# EAGLE design BlinkMuinoShield (EAGLE 5.11)
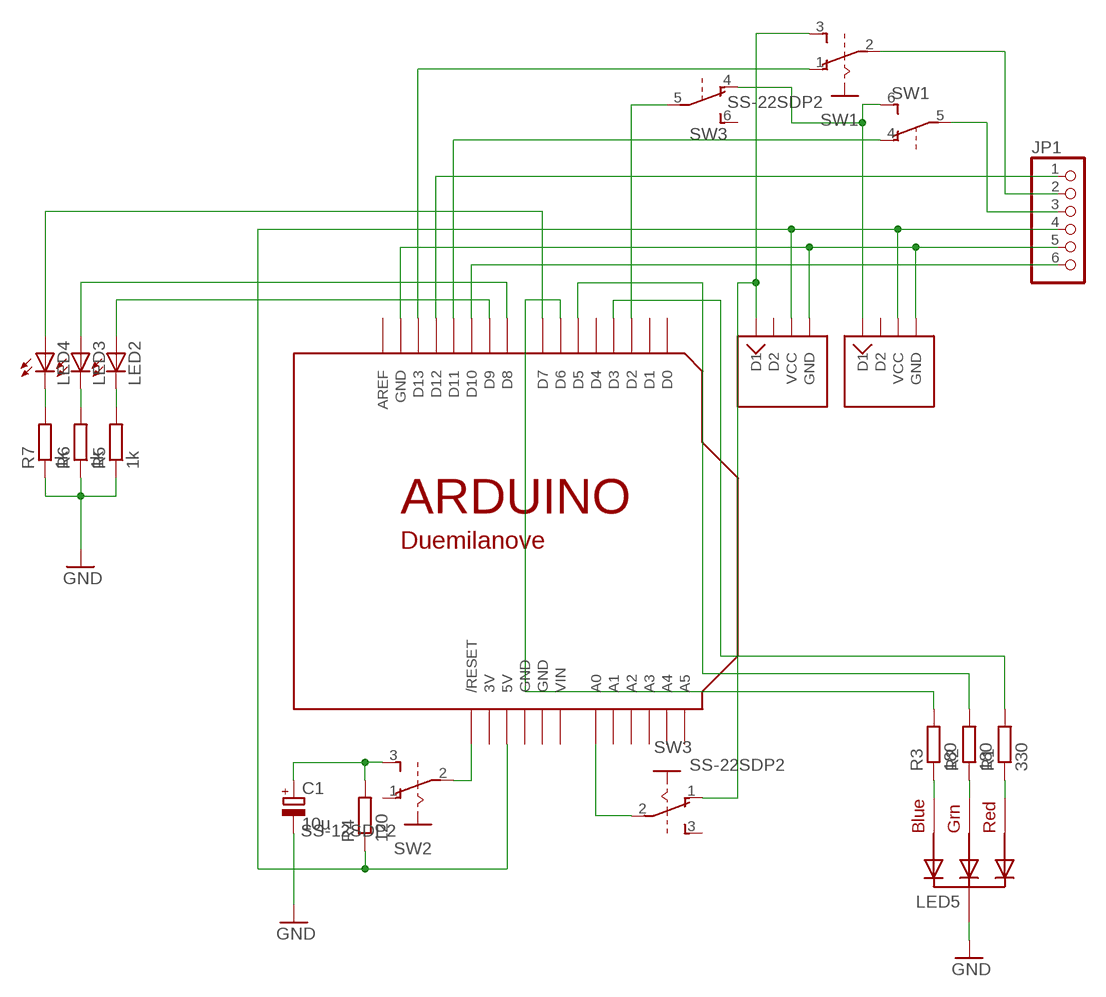
[diagram p0: schematic, sheet 1]

## Parts
C1  10µ  CPOL-EUE2.5-5  [E2,5-5]
JP1  PINHD-1X6LOCK  [1X06-BIGLOCK]
LED2  LED3MM  [LED3MM]
LED3  LED3MM  [LED3MM]
LED4  LED3MM  [LED3MM]
LED5  RGBLED_CK  [PIRANHA5MM]
R1  330  R-EU_0204/5  [0204/5]
R2  180  R-EU_0204/5  [0204/5]
R3  180  R-EU_0204/5  [0204/5]
R4  120  R-EU_0204/5  [0204/5]
R5  1k  R-EU_0204/5  [0204/5]
R6  1k  R-EU_0204/5  [0204/5]
R7  1k  R-EU_0204/5  [0204/5]
SW1  SS-22SDP2  [SS-22SDP2]
SW2  SS-12SDP2  [SS-12SDP2]
SW3  SS-22SDP2  [SS-22SDP2]
U$1  ARDUINODUEMILANOVE-NOHOLES  [ARDUINO-NOHOLE]
U$2  TWIG-4PIN  [TWIG-4PIN-L]
U$3  TWIG-4PIN  [TWIG-4PIN-L]

## Nets
GND: C1.- JP1.5 LED5.2(GND) R5.1 R6.1 R7.1 U$1.GND U$2.GND U$3.GND
N$1: JP1.6 U$1.D10
N$2: SW2.2(P) U$1.RESET(/RESET)
N$3: JP1.4 R4.1 U$1.5V U$2.VCC U$3.VCC
N$4: JP1.1 U$1.D12
N$5: SW1.1(O) U$1.D13
N$6: JP1.2 SW1.2(P)
N$7: JP1.3 SW1.5(P)
N$8: SW1.4(O) U$1.D11
N$9: SW1.3(S) SW3.1(O) U$2.D1
N$10: SW1.6(S) SW3.4(O) U$3.D1
N$11: C1.+ R4.2 SW2.3(S)
N$12: SW3.2(P) U$1.A0
N$13: SW3.5(P) U$1.D2
N$14: LED5.3(BLUE) R3.1
N$15: LED5.1(GREEN) R2.1
N$16: LED5.4(RED) R1.1
N$17: R1.2 U$1.D3
N$18: R2.2 U$1.D5
N$19: R3.2 U$1.D6
N$21: LED2.A U$1.D9
N$22: LED3.A U$1.D8
N$23: LED4.A U$1.D7
N$24: LED4.K(C) R7.2
N$25: LED3.K(C) R6.2
N$26: LED2.K(C) R5.2
Unconnected: SW2.1(O) SW3.3(S) SW3.6(S) U$1.A1 U$1.A2 U$1.A3 U$1.A4 U$1.A5 U$1.AREF U$1.D0 U$1.D1 U$1.D4 U$2.D2 U$3.D2

## Power pins joined to a net without a drawn wire
3V: U$1.3V
GND: U$1.GND1(GND) U$1.GND2(GND)
VIN: U$1.VIN

## Library data of the parts
C1 = rcl:CPOL-EU: POLARIZED CAPACITOR, European symbol
JP1 = adafruit:PINHD-1X6: PIN HEADER
LED2-LED4 = SparkFun:LED: LEDs Standard schematic elements and footprints for 5mm, 3mm, 1206, and 0603 sized LEDs. 5mm - Spark Fun Electronics SKU : COM-00529 (and others)
LED5 = kotobuki:RGBLED_CK
R1-R7 = rcl:R-EU_: RESISTOR, European symbol
SW1 SW3 = nikkai_ss:SS-22S
SW2 = nikkai_ss:SS-12S
U$1 = kotobuki:ARDUINO: Arduino Diecimila/Duemilanove Make a shield with ease, this package has all the named pins as well as the two mounting drill holes and an outline of the USB and DC power connector. The outline is on the DIMENSION layer, so if your board house uses it they will cut the outline to match. http://www.ladyada.net/library/pcb/eaglelibrary.html
U$2 U$3 = kotobuki:TWIG-4PIN

## Board
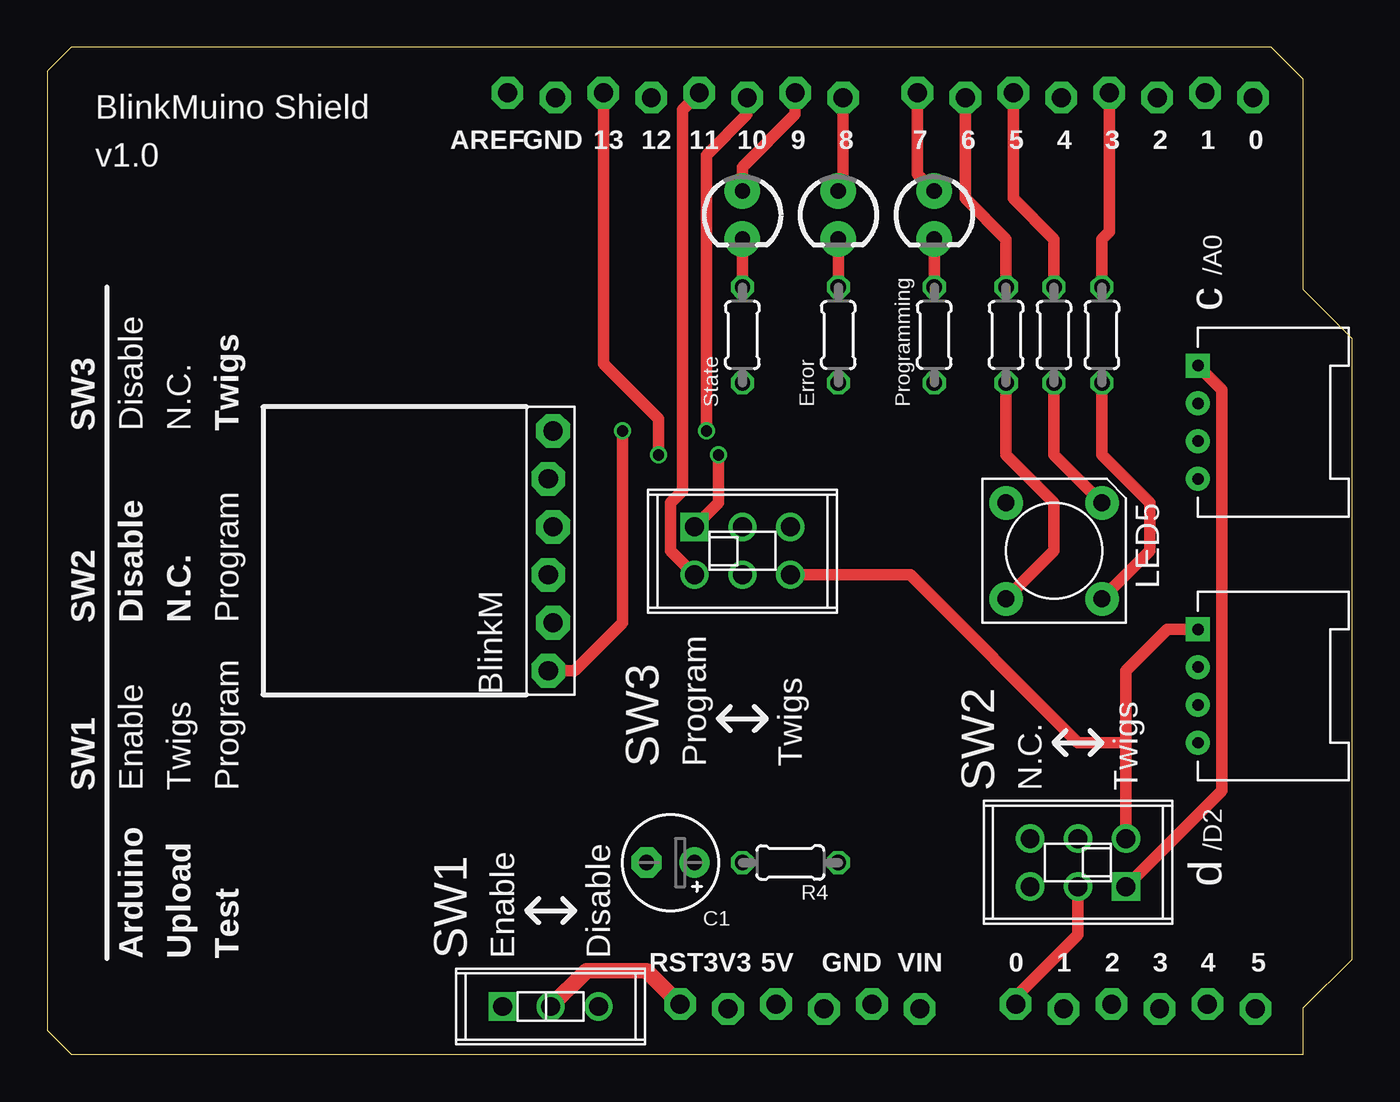
[diagram p1: board, top side]
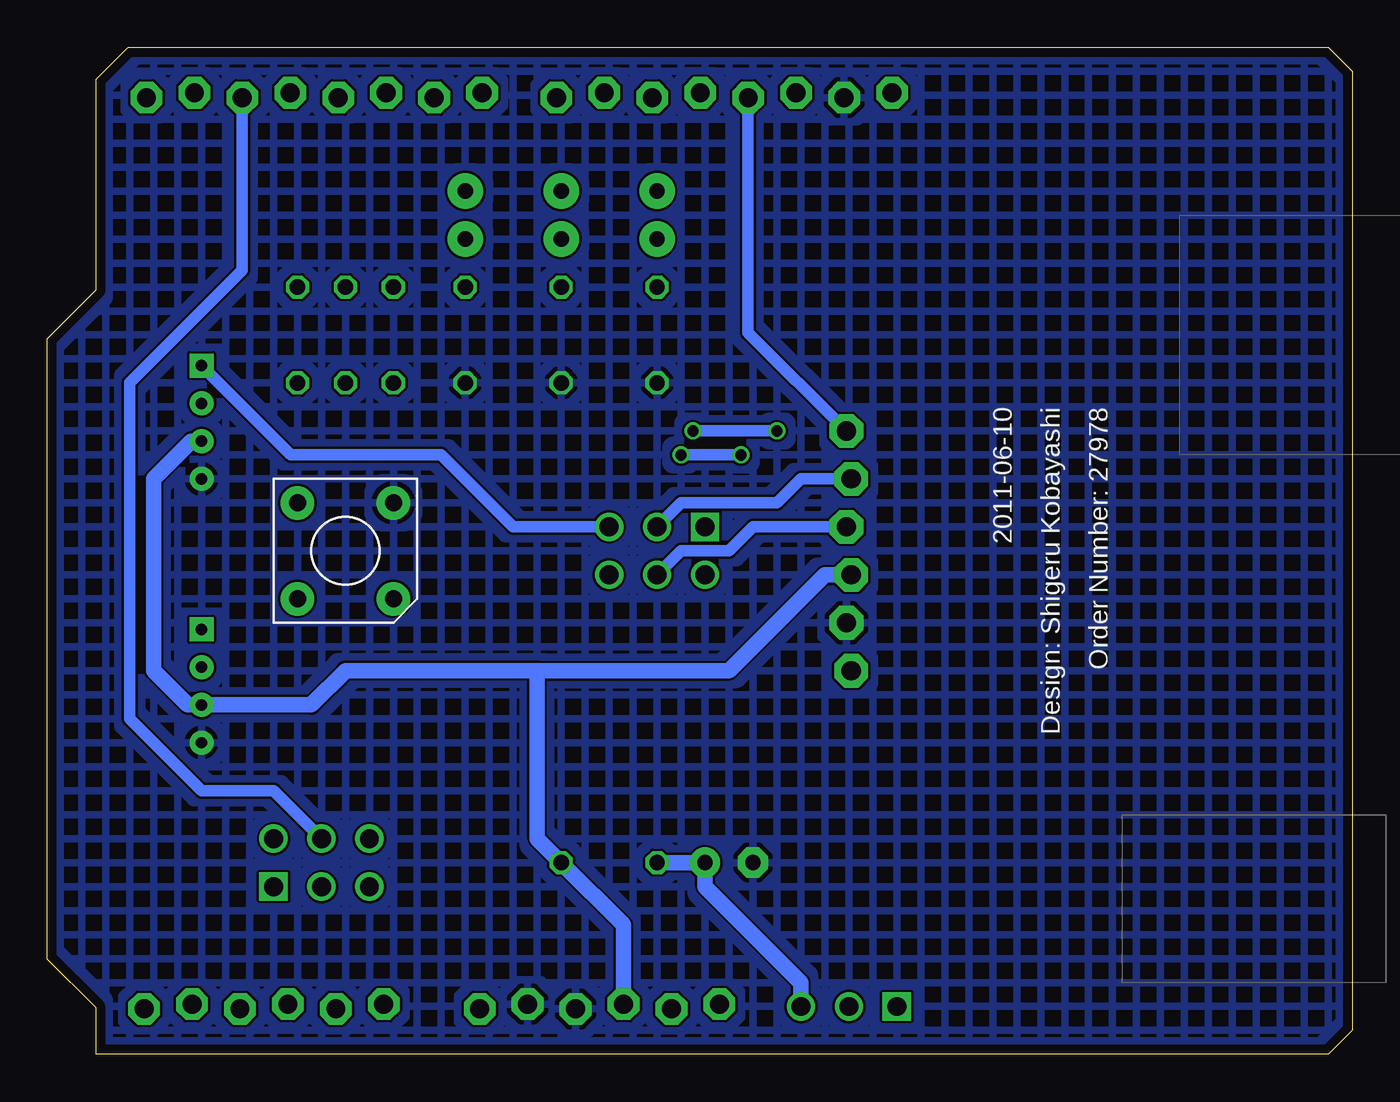
[diagram p2: board, bottom side, seen from below]

Size 69.14 x 53.34 mm. Coordinates in mm from the lower left corner, seen from the top.
Copper layers (1*16): Top 0.035mm / dielectric 1.5mm / Bottom 0.035mm
Design rules "p_ban_2layer": minimum track width 5mil, minimum drill 0.3mm, track to track 5mil, track to pad 5mil, pad to pad 5mil, via to via 5mil, smd to smd 5mil, copper to edge 0.5mm, drill to drill 0.3mm, minimum pad ring 0.15mm, minimum via ring 0.15mm, stop-mask expansion 4mil, vias tented up to drill 0.35mm, thermal gap 10mil

### Footprints (pad centres in the part's own frame; a part is rotated, then mirrored left to right if it is on the bottom)
E2,5-5 = drill 0.813 pad 1.6 round: + -1.27,0 | drill 0.813 pad 1.6 octagon: - 1.27,0
1X06-BIGLOCK = drill 1.016 pad 1.778 octagon: 1 -6.35,0.127; 2 -3.81,-0.127; 3 -1.27,0.127; 4 1.27,-0.127; 5 3.81,0.127; 6 6.35,-0.127
LED3MM = drill 0.813 pad 1.88 round: A -1.27,0; K 1.27,0
PIRANHA5MM = drill 0.9 pad 1.778 round: 1 -2.54,2.54; 2 -2.54,-2.54; 3 2.54,-2.54; 4 2.54,2.54
0204/5 = drill 0.813 octagon: 1 -2.54,0; 2 2.54,0
SS-22SDP2 = drill 1 square: 1 -2.54,1.27 | drill 1 round: 2 0,1.27; 3 2.54,1.27; 4 -2.54,-1.27; 5 0,-1.27; 6 2.54,-1.27
SS-12SDP2 = drill 1 square: 1 -2.54,0 | drill 1 round: 2 0,0; 3 2.54,0
ARDUINO-NOHOLE = drill 1 pad 1.676 octagon: 3V 36.068,2.413; 5V 38.608,2.667; A0 51.308,2.667; A1 53.848,2.413; A2 56.388,2.667; A3 58.928,2.413; A4 61.468,2.667; A5 64.008,2.413; AREF 24.384,50.927; D0 63.881,50.673; D1 61.341,50.927; D2 58.801,50.673; D3 56.261,50.927; D4 53.721,50.673; D5 51.181,50.927; D6 48.641,50.673; D7 46.101,50.927; D8 42.164,50.673; D9 39.624,50.927; D10 37.084,50.673; D11 34.544,50.927; D12 32.004,50.673; D13 29.464,50.927; GND 26.924,50.673; GND1 43.688,2.667; GND2 41.148,2.413; RESET 33.528,2.667; VIN 46.228,2.413
TWIG-4PIN-L = drill 0.6 pad 1.27 square: D1 0,-6 | drill 0.6 pad 1.27 round: D2 0,-4; GND 0,0; VCC 0,-2

### Placement (x,y rotation side)
C1  33.02,10.16 180 top
JP1  26.67,26.67 270 top
LED2  36.83,44.45 270 top
LED3  41.91,44.45 270 top
LED4  46.99,44.45 270 top
LED5  53.34,26.67 270 top
R1  55.88,38.1 90 top
R2  53.34,38.1 90 top
R3  50.8,38.1 90 top
R4  39.37,10.16 180 top
R5  36.83,38.1 90 top
R6  41.91,38.1 90 top
R7  46.99,38.1 90 top
SW1  36.83,26.67 0 top
SW2  26.67,2.54 0 top
SW3  54.61,10.16 180 top
U$1  0,0 0 top
U$2  60.96,30.48 180 top
U$3  60.96,16.51 180 top

### Tracks (layer width: path | path; a pad name or v marks a point on that pad's centre or on a via)
GND
  pour Bottom (hatched): -1.27,54.61 71.12,54.61 71.12,-1.27 -1.27,-1.27
N$1  (via drill 0.6)
  Top 0.61: U$1.D10 37.08,49.78 34.92,47.62 v34.92,33.02 | v30.48,33.02 30.48,22.86 27.94,20.32 JP1.6
  Bottom 0.61: v30.48,33.02 v34.92,33.02
N$2
  Top 0.813: SW2.2 28.57,4.45 31.75,4.45 U$1.RESET
N$3
  Bottom 0.813: JP1.4 27.94,25.4 33.02,20.32 43.18,20.32 | 43.18,20.32 43.18,11.43 R4.1 38.61,6.86 U$1.5V | U$2.VCC 61.5,32.48 63.5,30.48 63.5,20.32 61.69,18.51 U$3.VCC 55.15,18.51 53.34,20.32 43.18,20.32
N$4
  Bottom 0.61: U$1.D12 32,38.23 JP1.1
N$5  (via drill 0.6)
  Top 0.61: U$1.D13 29.46,36.58 32.38,33.66 v32.38,31.75 | SW1.1 35.56,29.21 v35.56,31.75
  Bottom 0.61: v35.56,31.75 v32.38,31.75
N$6
  Bottom 0.61: JP1.2 27.94,30.48 29.21,30.48 30.48,29.21 35.56,29.21 SW1.2
N$7
  Bottom 0.61: JP1.3 27.94,27.94 31.75,27.94 33.02,26.67 35.56,26.67 SW1.5
N$8
  Top 0.61: U$1.D11 33.66,50.04 33.66,29.84 33.02,29.21 33.02,26.67 SW1.4
N$9
  Top 0.61: SW3.1 62.23,13.97 62.23,35.21 U$2.D1
  Bottom 0.61: SW1.3 44.45,27.94 48.26,31.75 56.23,31.75 U$2.D1
N$10
  Top 0.61: SW1.6 45.72,25.4 54.61,16.51 57.15,16.51 | 57.15,16.51 SW3.4 | U$3.D1 59.34,22.51 57.15,20.32 57.15,16.51
N$11
  Bottom 0.813: R4.2 C1.+ 34.29,8.89 29.21,3.81 SW2.3
N$12
  Top 0.61: SW3.2 54.61,6.35 51.31,3.05 U$1.A0
N$13
  Bottom 0.61: U$1.D2 58.8,41.53 64.77,35.56 64.77,17.78 60.96,13.97 57.15,13.97 SW3.5
N$14
  Top 0.61: R3.1 50.8,31.75 53.34,29.21 53.34,26.67 LED5.3
N$15
  Top 0.61: LED5.1 53.34,31.75 R2.1
N$16
  Top 0.61: LED5.4 58.42,26.67 58.42,29.21 55.88,31.75 R1.1
N$17
  Top 0.61: U$1.D3 56.26,43.56 55.88,43.18 R1.2
N$18
  Top 0.61: U$1.D5 51.18,45.34 53.34,43.18 R2.2
N$19
  Top 0.61: U$1.D6 48.64,45.34 50.8,43.18 R3.2
N$21
  Top 0.61: U$1.D9 39.62,49.78 36.83,46.99 LED2.A
N$22
  Top 0.61: U$1.D8 42.16,45.97 LED3.A
N$23
  Top 0.61: U$1.D7 46.1,46.61 LED4.A
N$24
  Top 0.61: R7.2 LED4.K
N$25
  Top 0.61: R6.2 LED3.K
N$26
  Top 0.61: R5.2 LED2.K

### Text on the board
tNames: BlinkMuino Shield | v1.0 | /A0 | c | State | Error | Programming | SW3 | Disable | N.C. | Twigs | SW2 | Disable | N.C. | Program | BlinkM | SW3 | Program | Twigs | SW1 | Enable | Twigs | Program | SW2 | N.C. | Twigs | /D2 | d | Arduino | Upload | Test | SW1 | Enable | Disable
bNames: Order Number: 27978 | Design: Shigeru Kobayashi | 2011-06-10